# Altium schematic sheet Title Page.SchDoc: Renesas Public Template
size A3; Author: M. Merrill; Company Name: Renesas Electronics America; Organization: Renesas Electronics; Address1: 915 Murphy Ranch Road; Address2: Milpitas, CA  95035; DocumentNumber: 1; Revision: 01; SheetNumber: 1; SheetTotal: 2; CompanyURL: www.renesas.com; PageSetup: Record=PageOptions|CenterHorizontal=True|CenterVertical=True|PrintScale=1.00|XCorrection=1.00|YCorrection=1.00|PrintKind=1|BorderSize=5000000|LeftOffset=0|BottomOffset=0|Orientation=2|PaperLength=1000|PaperWidth=1000|Scale=100|PaperSource=7|PrintQuality=-4|MediaType=1|DitherType=10|PaperKind=A5 148x210mm|PrintScaleMode=1
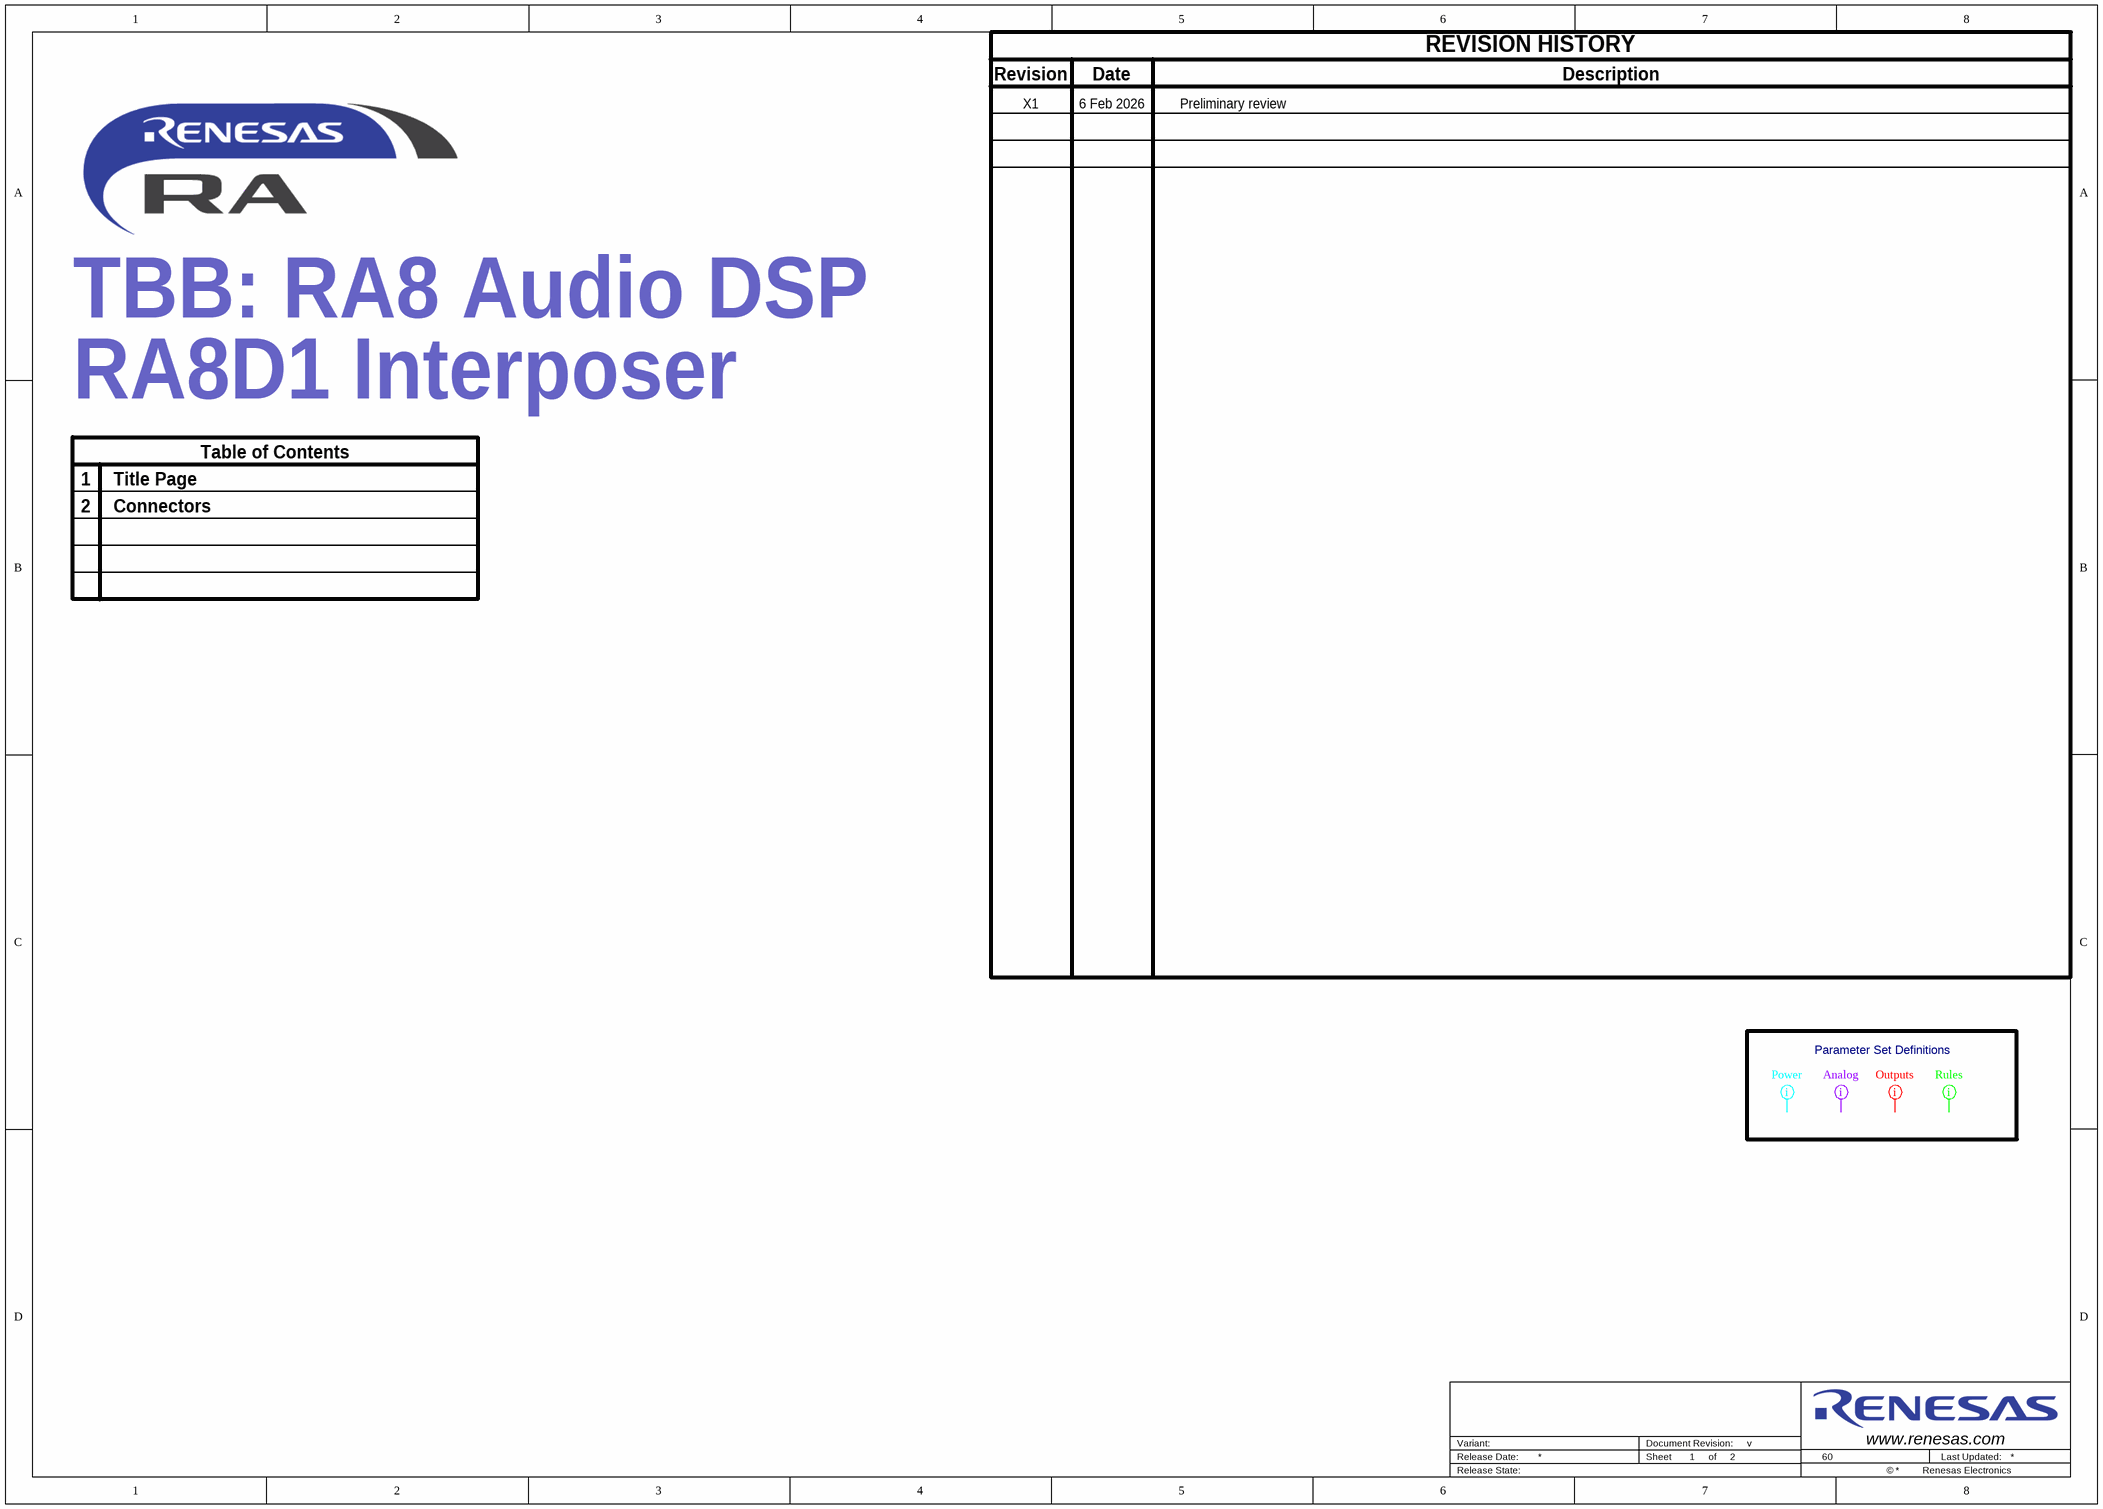
[diagram p0: Title Page.SchDoc]

## Layout directives
net class Power: (no net found under the mark)
net class Analog: (no net found under the mark)
net class Outputs: (no net found under the mark)
net class Rules: (no net found under the mark)

## Notes on the sheet
- Revision
- X1
- Date
- 6 Feb 2026
- Preliminary review
- REVISION HISTORY
- Description
- TBB: RA8 Audio DSP
- RA8D1 Interposer
- 1
- 2
- Title Page
- Connectors
- Table of Contents
- Parameter Set Definitions
- Variant:
- Release Date:
- Document Revision:
- Sheet
- of
- v
- 60
- www.renesas.com <http://www.renesas.com>
- Last Updated:
- Release State:
- ©
- Renesas Electronics